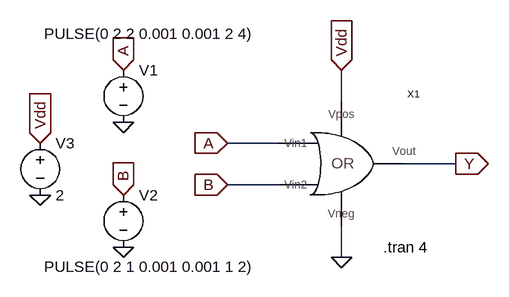
[diagram p0: schematic OR_TESTING.asc]
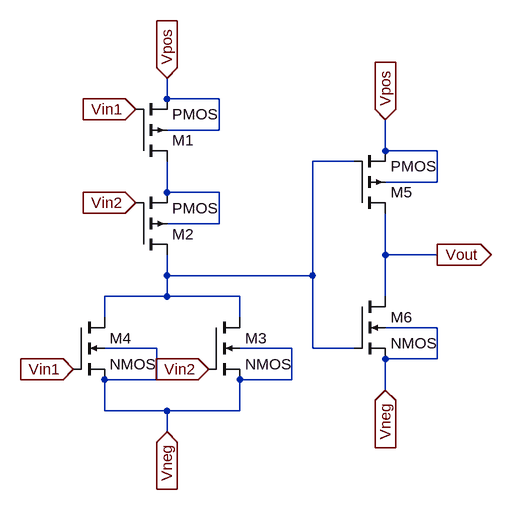
[diagram p1: sub-circuit or_sym.asc]
OR_TESTING.asc, the LTspice schematic file:
Version 4
SHEET 1 880 680
WIRE 208 64 208 16
WIRE 112 128 32 128
WIRE 384 160 304 160
WIRE 112 192 32 192
WIRE 208 304 208 256
FLAG 32 128 A
IOPIN 32 128 In
FLAG 32 192 B
IOPIN 32 192 In
FLAG 208 16 Vdd
IOPIN 208 16 In
FLAG -256 128 Vdd
IOPIN -256 128 In
FLAG -128 16 A
IOPIN -128 16 In
FLAG -128 208 B
IOPIN -128 208 In
FLAG -128 96 0
FLAG -256 208 0
FLAG -128 288 0
FLAG 208 304 0
FLAG 384 160 Y
IOPIN 384 160 Out
SYMBOL OR_SYM 224 160 R0
SYMATTR InstName X1
SYMBOL voltage -128 0 R0
WINDOW 3 -122 -40 Left 2
WINDOW 123 0 0 Left 0
WINDOW 39 0 0 Left 0
SYMATTR InstName V1
SYMATTR Value PULSE(0 2 2 0.001 0.001 2 4)
SYMBOL voltage -128 192 R0
WINDOW 3 -122 126 Left 2
WINDOW 123 0 0 Left 0
WINDOW 39 0 0 Left 0
SYMATTR InstName V2
SYMATTR Value PULSE(0 2 1 0.001 0.001 1 2)
SYMBOL voltage -256 112 R0
WINDOW 123 0 0 Left 0
WINDOW 39 0 0 Left 0
SYMATTR InstName V3
SYMATTR Value 2
TEXT 272 288 Left 2 !.tran 4

or_sym.asc, the sub-circuit schematic file:
Version 4
SHEET 1 880 680
WIRE 128 -128 128 -160
WIRE 208 -128 128 -128
WIRE 208 -80 208 -128
WIRE 208 -80 128 -80
WIRE 464 -48 464 -96
WIRE 544 -48 464 -48
WIRE 416 -32 352 -32
WIRE 544 0 544 -48
WIRE 544 0 464 0
WIRE 128 16 128 -32
WIRE 208 16 128 16
WIRE 208 64 208 16
WIRE 208 64 128 64
WIRE 464 112 464 48
WIRE 544 112 464 112
WIRE 128 144 128 112
WIRE 352 144 352 -32
WIRE 352 144 128 144
WIRE 128 176 128 144
WIRE 128 176 32 176
WIRE 240 176 128 176
WIRE 464 176 464 112
WIRE 32 208 32 176
WIRE 240 208 240 176
WIRE 544 224 464 224
WIRE 112 256 32 256
WIRE 320 256 240 256
WIRE 352 256 352 144
WIRE 416 256 352 256
WIRE 544 272 544 224
WIRE 544 272 464 272
WIRE 112 304 112 256
WIRE 112 304 32 304
WIRE 320 304 320 256
WIRE 320 304 240 304
WIRE 464 320 464 272
WIRE 32 352 32 304
WIRE 128 352 32 352
WIRE 240 352 240 304
WIRE 240 352 128 352
WIRE 128 384 128 352
FLAG 128 -160 Vpos
IOPIN 128 -160 In
FLAG 128 384 Vneg
IOPIN 128 384 In
FLAG -16 288 Vin1
IOPIN -16 288 In
FLAG 192 288 Vin2
IOPIN 192 288 In
FLAG 80 -112 Vin1
IOPIN 80 -112 In
FLAG 80 32 Vin2
IOPIN 80 32 In
FLAG 544 112 Vout
IOPIN 544 112 Out
FLAG 464 -96 Vpos
IOPIN 464 -96 In
FLAG 464 320 Vneg
IOPIN 464 320 In
SYMBOL pmos4 80 -32 M180
SYMATTR InstName M1
SYMBOL pmos4 80 112 M180
SYMATTR InstName M2
SYMBOL nmos4 192 208 R0
SYMATTR InstName M3
SYMBOL nmos4 -16 208 R0
SYMATTR InstName M4
SYMBOL pmos4 416 48 M180
SYMATTR InstName M5
SYMBOL nmos4 416 176 R0
SYMATTR InstName M6

The netlist it stands for:
* OR_TESTING.asc
XX1 Vdd A B Y 0 or_sym
V1 A 0 PULSE(0 2 2 0.001 0.001 2 4)
V2 B 0 PULSE(0 2 1 0.001 0.001 1 2)
V3 Vdd 0 2

* block symbol definitions
.subckt or_sym Vpos Vin1 Vin2 Vout Vneg
M1 N002 Vin1 Vpos Vpos PMOS
M2 N001 Vin2 N002 N002 PMOS
M3 N001 Vin2 Vneg Vneg NMOS
M4 N001 Vin1 Vneg Vneg NMOS
M5 Vout N001 Vpos Vpos PMOS
M6 Vout N001 Vneg Vneg NMOS
.ends or_sym

.model NMOS NMOS
.model PMOS PMOS
.lib standard.mos
.tran 4
.backanno
.end

* Results of the author's LTspice run, read from the files saved beside the schematic
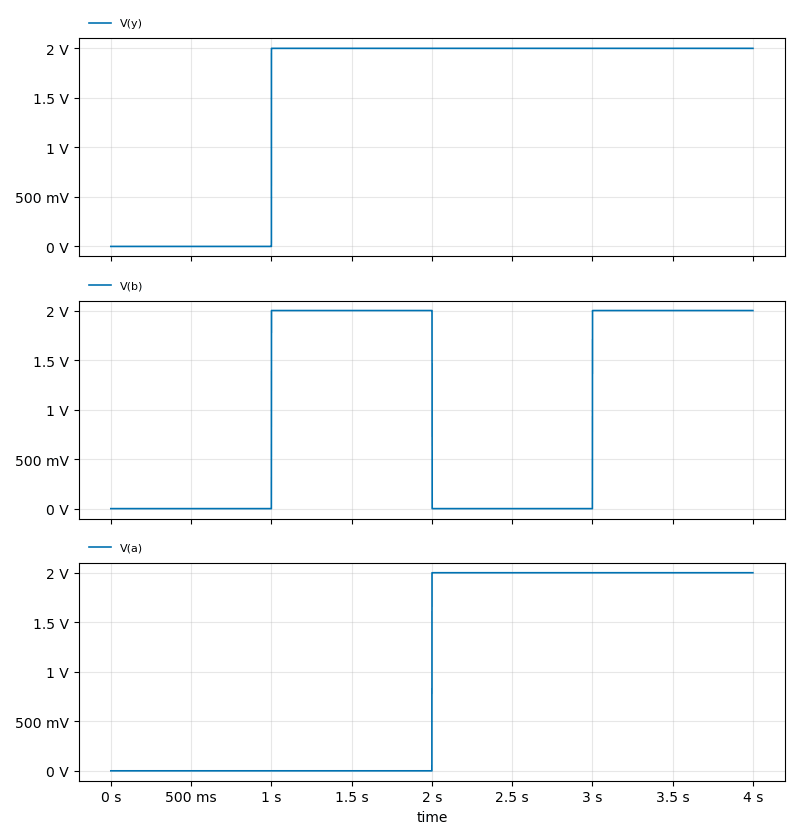
[diagram p2: Transient Analysis of OR_TESTING.asc, plotted from the saved traces]
* Transient Analysis, 1 run:
*   V(y): min 0 V, max 2 V, average 1.5 V, rms 1.732 V, last 2 V
*   V(b): min 0 V, max 2 V, average 1 V, rms 1.414 V, last 2 V
*   V(a): min 0 V, max 2 V, average 999.8 mV, rms 1.414 V, last 2 V